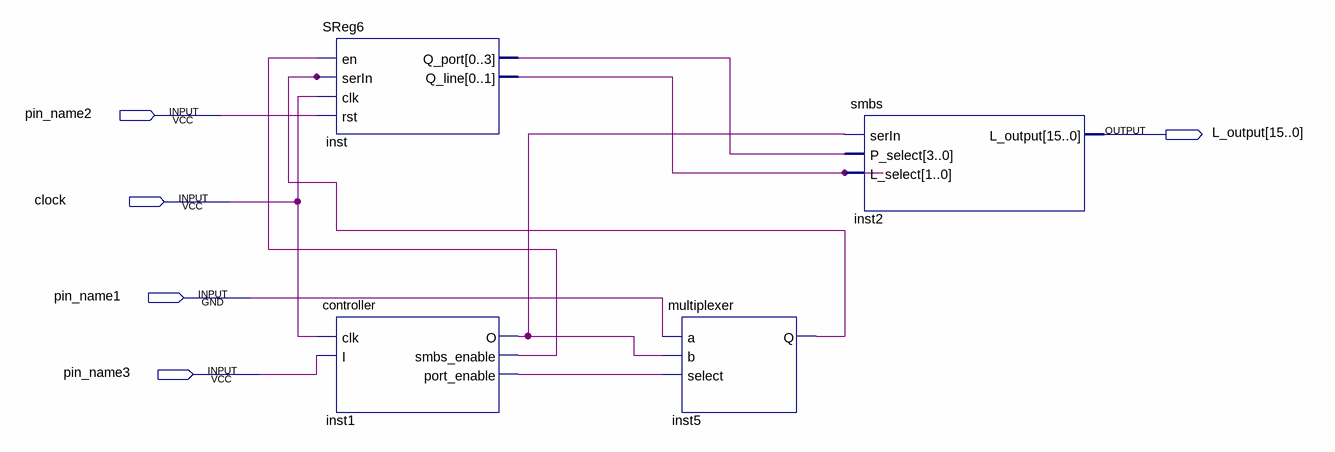
[diagram p0: schematic sheet]
// Quartus schematic CA4.bdf as structural Verilog: 4 symbols, 5 pins
module CA4 (
  input  pin_name2,
  input  clock,
  input  pin_name1,
  input  pin_name3,
  output [15:0] L_output
);

  wire inst1_o, inst1_port_enable, inst1_smbs_enable, inst5_q;
  wire [1:0] inst_q_line;
  wire [3:0] inst_q_port;

  SReg6 inst (
    .en(inst1_smbs_enable), .serIn(inst5_q), .clk(clock), .rst(pin_name2), .Q_port(inst_q_port),
    .Q_line(inst_q_line));
  controller inst1 (
    .clk(clock), .I(pin_name3), .O(inst1_o), .smbs_enable(inst1_smbs_enable), .port_enable(inst1_port_enable));
  multiplexer inst5 (.a(pin_name1), .b(inst1_o), .select(inst1_port_enable), .Q(inst5_q));
  smbs inst2 (.serIn(inst1_o), .P_select(inst_q_port), .L_select(inst_q_line), .L_output(L_output));
endmodule
